# Altium schematic sheet WIEGAND_INTERFACE.SchDoc
size A4; SheetNumber: 21; SheetTotal: 27
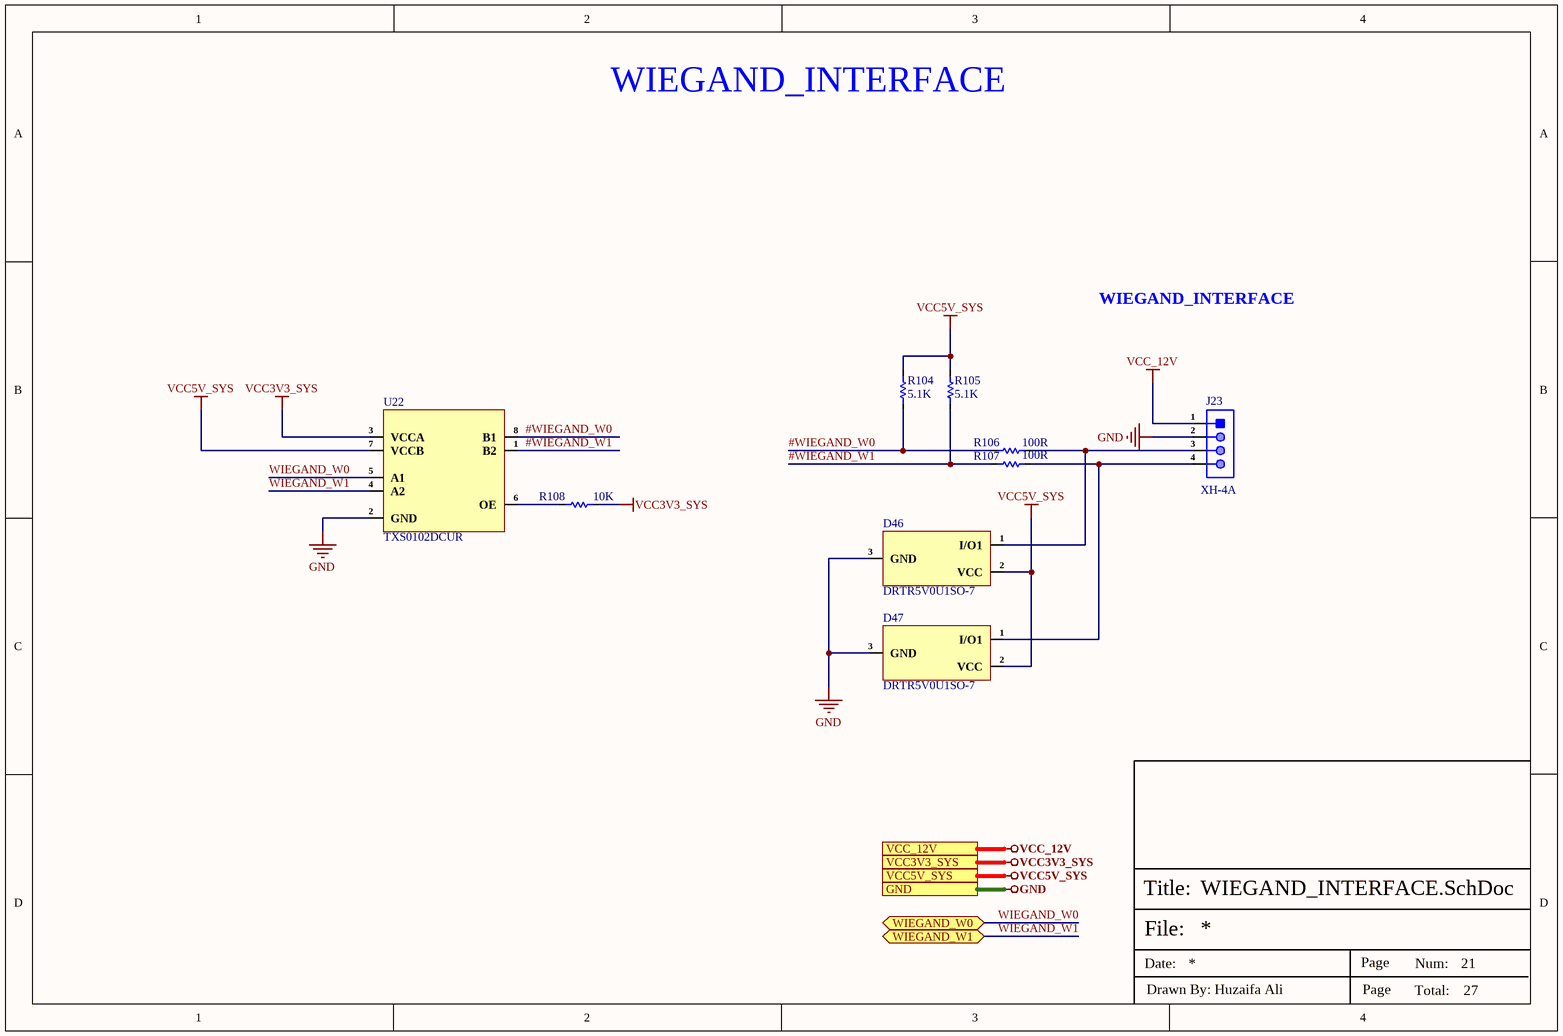
[diagram p0: WIEGAND_INTERFACE.SchDoc]

## Parts
D46  DRTR5V0U1SO-7  [SOT-23]
D47  DRTR5V0U1SO-7  [SOT-23]
J23  XH-4A  [XH-4A]
R104  5.1K  [Res-0402]
R105  5.1K  [Res-0402]
R106  100R  [Res-0402]
R107  100R  [Res-0402]
R108  10K  [Res-0402]
U22  TXS0102DCUR  [VSSOP-8(3.1x2.1)]

## Ports
GND (see TOP SHEET[3D], AUDIO_INTERFACE[1D], BUCK REGULATOR[3D], DEBUG_UART_INTERFACE[3D], DIGITAL IO_RELAY_SHEET[5D], DUAL_SIM_INTERFACE[3D], ETHERNET_PHY0[4D], ETHERNET_PHY1[4D], GSM_INTERFACE[2D], HDMI_INTERFACE[3D], INPUT_PROTECTION[3D], LINEAR_VOLTAGE_REG[3D], MICRO_SD_INTERFACE[3D], MIPI-DSI DISPLAY[3D], POWER SECTION[3D], PUSH BUTTONs_INTERFACE[3C], RGB_LEDs_INTERFACE[3D], ROCKCHIP_PWR_SUPPLY[1D], ROCKCHIP_SYSTEM_CONTROL[3C], RS232_RS485_INTERFACE[3C], SENSOR_SHEET[3D], USB2.0_INTERFACE[3D], USB3.0_INTERFACE[3D], USB-C_INTERFACE[2D], WIFI_BLUETOOTH_SHEET[4C]), VCC3V3_SYS (see TOP SHEET[3D], AUDIO_INTERFACE[1D], BUCK REGULATOR[3D], DEBUG_UART_INTERFACE[3D], DIGITAL IO_RELAY_SHEET[5D], ETHERNET_PHY0[4D], ETHERNET_PHY1[4D], GSM_INTERFACE[2D], HDMI_INTERFACE[3D], LINEAR_VOLTAGE_REG[3D], MIPI-DSI DISPLAY[3D], POWER SECTION[3D], PUSH BUTTONs_INTERFACE[3C], ROCKCHIP_PWR_SUPPLY[1D], ROCKCHIP_SYSTEM_CONTROL[3C], RS232_RS485_INTERFACE[3C], SENSOR_SHEET[3D], USB-C_INTERFACE[2D], WIFI_BLUETOOTH_SHEET[4C]), VCC5V_SYS (see TOP SHEET[3D], BUCK REGULATOR[3D], DIGITAL IO_RELAY_SHEET[5D], HDMI_INTERFACE[3D], LINEAR_VOLTAGE_REG[3D], MIPI-DSI DISPLAY[3D], POWER SECTION[3D], RGB_LEDs_INTERFACE[3D], ROCKCHIP_PWR_SUPPLY[1D], USB2.0_INTERFACE[3D], USB3.0_INTERFACE[3D], USB-C_INTERFACE[2D]), VCC_12V (see TOP SHEET[3D], AUDIO_INTERFACE[1D], BUCK REGULATOR[3D], INPUT_PROTECTION[3D], POWER SECTION[3D], PUSH BUTTONs_INTERFACE[3C]), WIEGAND_W0 (bidir, see TOP SHEET[3D], ROCKCHIP_GPIO_NC PINS[2D]), WIEGAND_W1 (bidir, see TOP SHEET[3D], ROCKCHIP_GPIO_NC PINS[2D])

## Nets
GND: D46.3(GND) D47.3(GND) J23.2 U22.2(GND) ; port GND
VCC3V3_SYS: R108.2 U22.3(VCCA) ; port VCC3V3_SYS
VCC5V_SYS: D46.2(VCC) D47.2(VCC) R104.2 R105.2 U22.7(VCCB) ; port VCC5V_SYS
VCC_12V: J23.1 ; port VCC_12V
#WIEGAND_W0: R104.1 R106.1 U22.8(B1)
#WIEGAND_W1: R105.1 R107.1 U22.1(B2)
WIEGAND_W0: U22.5(A1) ; port WIEGAND_W0
WIEGAND_W1: U22.4(A2) ; port WIEGAND_W1
NetD46_1: D46.1(I/O1) J23.3 R106.2
NetD47_1: D47.1(I/O1) J23.4 R107.2
NetR108_1: R108.1 U22.6(OE)

## Notes on the sheet
- WIEGAND_INTERFACE
- File:
- Title:
- Date:
- Page
- Num:
- Total:
- Drawn By: Huzaifa Ali

## Library data of the parts
D46 D47 = DRTR5V0U1SO-7: TVS DIODE 5.5VWM SOT23; Manufacturer: Diodes; Item Type: (TVS/ESD); Supplier: Digikey; Supplier Part Number: DRTR5V0U1SO-7DICT-ND; Manufacturer Part Number: DRTR5V0U1SO-7; RoHS: Yes; Category: TVS Diodes; Stock: 83982; Pricing: 1=0.34, 10=0.238, 100=0.1201, 500=0.098, 1000=0.07271 (USD); ComponentLink1URL: http://www.farnell.com/datasheets/2814436.pdf?src-supplier=Farnell; ComponentLink1Description: http://www.farnell.com/datasheets/2814436.pdf?src-supplier=Farnell; ComponentLink2URL: http://www.mouser.com/ds/2/115/DRTR5V0U1SO-271637.pdf?src-supplier=Mouser; ComponentLink2Description: http://www.mouser.com/ds/2/115/DRTR5V0U1SO-271637.pdf?src-supplier=Mouser; ComponentLink3URL: http://www.diodes.com/datasheets/DRTR5V0U1SO.pdf?src-supplier=Avnet; ComponentLink3Description: http://www.diodes.com/datasheets/DRTR5V0U1SO.pdf?src-supplier=Avnet; LCSC Part Number: C1973123
J23 = XH-4A: 1x4P 4P XH 1 Tin 2.5mm 4 -25℃~+85℃ Brass 3A Straight Plugin,P=2.5mm Wire To Board Connector ROHS; Manufacturer: HCTL; Manufacturer Part Number: XH-4A; Package: Plugin,P=2.5mm; LCSC Part Number: C2908602; Item Type: Wire To Board Connector; ComponentLink1Description: LCSC; ComponentLink1URL: https://www.lcsc.com/product-detail/Wire-To-Board-Connector_HCTL-XH-4A_C2908602.html
R104 R105 = RC0402FR-075K1L: RES 5.1K OHM 1% 1/16W 0402; Manufacturer: Yageo; Power Rating: 63mW; Resistance: 5.1kR; Temperature Coefficient: 100ppm/°C; Voltage Rating: 50V; Item Type: Resistor; Supplier 1: Avnet; Manufacturer Part Number: RC0402FR-075K1L; RoHS: Yes; Category: Chip SMD Resistors; Stock 1: 65000; Pricing 1: 10000=0.00085 (USD); Case/Package: 0402; Case Code (Metric): 1005; Case Code (Imperial): 0402; Min Operating Temperature: -55°C; Max Operating Temperature: 155°C; Tolerance: 1%; Technology: THICK FILM; Packaging: Tape and Reel; Package Quantity: 1; Resistor Type: Thick Film; Number of Terminations: 2; Termination: SMD/SMT; Max Power Dissipation: 63mW; Voltage Rating (DC): 50V; Working Voltage: 50V; Features: Moisture Resistant; Series: RC; Resistance Tolerance: 1%; Construction: Rectangular; Length: 1mm; Width: 0.02inch; Height: 0.016inch; Depth: 0.5mm; RoHS Compliant: Yes; Military Standard: Not; Lead Free: Lead Free; ComponentLink1URL: https://datasheet.ciiva.com/7983/1018594-7983519.pdf?src-supplier=Element14; ComponentLink1Description: https://datasheet.ciiva.com/7983/1018594-7983519.pdf?src-supplier=Element14; ComponentLink2URL: https://datasheet.ciiva.com/46394/1018594-46394936.pdf?src-supplier=Element14; ComponentLink2Description: https://datasheet.ciiva.com/46394/1018594-46394936.pdf?src-supplier=Element14; ComponentLink3URL: https://datasheet.ciiva.com/2453/pyu-r-int-thick-7-2453401.pdf?src-supplier=Digi-Key; ComponentLink3Description: https://datasheet.ciiva.com/2453/pyu-r-int-thick-7-2453401.pdf?src-supplier=Digi-Key; ComponentLink4URL: https://datasheet.ciiva.com/2453/pyu-r-int-thick-7-2453402.pdf?src-supplier=Digi-Key; ComponentLink4Description: https://datasheet.ciiva.com/2453/pyu-r-int-thick-7-2453402.pdf?src-supplier=Digi-Key; ComponentLink5URL: https://datasheet.ciiva.com/2453/pyu-r-int-thick-7-2453400.pdf?src-supplier=Digi-Key; ComponentLink5Description: https://datasheet.ciiva.com/2453/pyu-r-int-thick-7-2453400.pdf?src-supplier=Digi-Key; ComponentLink6URL: https://datasheet.ciiva.com/12558/pyu-rc0402-51-rohs-l-6-r-8721-12558460.pdf?src-supplier=Mouser; ComponentLink6Description: https://datasheet.ciiva.com/12558/pyu-rc0402-51-rohs-l-6-r-8721-12558460.pdf?src-supplier=Mouser; ComponentLink7URL: https://datasheet.ciiva.com/16744/pyu-rc0402-51-rohs-l-6-r-16744283.pdf?src-supplier=Future+Electronics; ComponentLink7Description: https://datasheet.ciiva.com/16744/pyu-rc0402-51-rohs-l-6-r-16744283.pdf?src-supplier=Future+Electronics; ComponentLink8URL: https://datasheet.ciiva.com/15189/getdatasheetpartid-323636-15189493.pdf?src-supplier=Verical; ComponentLink8Description: https://datasheet.ciiva.com/15189/getdatasheetpartid-323636-15189493.pdf?src-supplier=Verical; Supplier Part Number 1: RC0402FR-075K1L; LCSC Part Number: C105872
R106 R107 = RC0402FR-07100RL: RES 100 OHM 1% 1/16W 0402; Manufacturer: Yageo; Power Rating: 62.5mW; Voltage Rating: 50V; Temperature Coefficient: 100ppm/°C; Max Power Dissipation: 63mW; Item Type: Resistor; Supplier 1: Mouser; Manufacturer Part Number: RC0402FR-07100RL; RoHS: Yes; Category: Chip SMD Resistors; Stock 1: 699545; Pricing 1: 1=0.10000, 10=0.01200, 50=0.01200, 100=0.00500, 1000=0.00300, 2500=0.00200, 10000=0.00100 (USD); Case/Package: 0402; Number of Pins: 2; Case Code (Imperial): 0402; Case Code (Metric): 1005; Size Code: 0402; Min Operating Temperature: -55°C; Max Operating Temperature: 155°C; Tolerance: 1%; Voltage Rating (DC): 50V; Resistance: 100R; Packaging: Tape and Reel; Termination: SMD/SMT; Resistor Type: Thick Film; Features: Moisture Resistant; Series: RC; Number of Terminations: 2; Resistance Tolerance: 1%; Construction: Rectangular; Technology: THICK FILM; Length: 1mm; Width: 0.5mm; Height: 0.32mm; Depth: 0.5mm; RoHS Compliant: Yes; REACH SVHC: No SVHC; Military Standard: Not; Lead Free: Lead Free; ComponentLink1URL: https://datasheet.ciiva.com/11808/0900766b80c66297-11808765.pdf?src-supplier=RSComponents; ComponentLink1Description: https://datasheet.ciiva.com/11808/0900766b80c66297-11808765.pdf?src-supplier=RSComponents; ComponentLink2URL: https://datasheet.ciiva.com/7849/1784430-7849810.pdf?src-supplier=Element14; ComponentLink2Description: https://datasheet.ciiva.com/7849/1784430-7849810.pdf?src-supplier=Element14; ComponentLink3URL: https://datasheet.ciiva.com/28367/1018594-28367226.pdf?src-supplier=Element14; ComponentLink3Description: https://datasheet.ciiva.com/28367/1018594-28367226.pdf?src-supplier=Element14; ComponentLink4URL: https://datasheet.ciiva.com/22747/1018594-22747511.pdf?src-supplier=Element14; ComponentLink4Description: https://datasheet.ciiva.com/22747/1018594-22747511.pdf?src-supplier=Element14; ComponentLink5URL: https://datasheet.ciiva.com/12667/pyu-rc0402-51-rohs-l-6-r-12667957.pdf?src-supplier=Mouser; ComponentLink5Description: https://datasheet.ciiva.com/12667/pyu-rc0402-51-rohs-l-6-r-12667957.pdf?src-supplier=Mouser; ComponentLink6URL: https://datasheet.ciiva.com/15189/getdatasheetpartid-329466-15189335.pdf?src-supplier=Verical; ComponentLink6Description: https://datasheet.ciiva.com/15189/getdatasheetpartid-329466-15189335.pdf?src-supplier=Verical; ComponentLink7URL: https://datasheet.ciiva.com/16740/pyu-rc0402-51-rohs-l-6-r-16740566.pdf?src-supplier=Future+Electronics; ComponentLink7Description: https://datasheet.ciiva.com/16740/pyu-rc0402-51-rohs-l-6-r-16740566.pdf?src-supplier=Future+Electronics; Supplier Part Number 1: 603-RC0402FR-07100RL; LCSC Part Number: C106232
R108 = RC0402FR-0710KL: RES 10K OHM 1% 1/16W 0402; Manufacturer: Yageo; Resistance: 10kR; Voltage Rating (DC): 50V; Temperature Coefficient: 100ppm/°C; Power Rating: 62.5mW; Max Power Dissipation: 63mW; Item Type: Resistor; Supplier 1: Mouser; Manufacturer Part Number: RC0402FR-0710KL; RoHS: Yes; Category: Chip SMD Resistors; Stock 1: 18648329; Pricing 1: 1=0.10000, 10=0.01400, 50=0.01400, 100=0.00500, 1000=0.00300, 10000=0.00200 (USD); Case/Package: 0402; Number of Pins: 2; Case Code (Imperial): 0402; Case Code (Metric): 1005; Min Operating Temperature: -55°C; Max Operating Temperature: 155°C; Resistor Type: Thick Film; Tolerance: 1%; Packaging: Tape and Reel; Voltage Rating: 50V; Termination: SMD/SMT; Working Voltage: 50V; Number of Terminations: 2; Features: Moisture Resistant; Series: RC; Resistance Tolerance: 1%; Construction: Rectangular; Length: 1mm; Width: 0.5mm; Height: 0.32mm; Depth: 0.5mm; Lead Pitch: 0.2mm; REACH SVHC: No SVHC; Lead Free: Lead Free; RoHS Compliant: Yes; Military Standard: Not; ComponentLink1URL: https://datasheet.ciiva.com/7660/38568-7660787.pdf?src-supplier=Element14; ComponentLink1Description: https://datasheet.ciiva.com/7660/38568-7660787.pdf?src-supplier=Element14; ComponentLink2URL: https://datasheet.ciiva.com/7849/1686128-7849814.pdf?src-supplier=Element14; ComponentLink2Description: https://datasheet.ciiva.com/7849/1686128-7849814.pdf?src-supplier=Element14; ComponentLink3URL: https://datasheet.ciiva.com/7983/1018594-7983486.pdf?src-supplier=Element14; ComponentLink3Description: https://datasheet.ciiva.com/7983/1018594-7983486.pdf?src-supplier=Element14; ComponentLink4URL: https://datasheet.ciiva.com/22747/1018594-22747512.pdf?src-supplier=Element14; ComponentLink4Description: https://datasheet.ciiva.com/22747/1018594-22747512.pdf?src-supplier=Element14; ComponentLink5URL: https://datasheet.ciiva.com/12667/pyu-rc0402-51-rohs-l-6-r-12667067.pdf?src-supplier=Mouser; ComponentLink5Description: https://datasheet.ciiva.com/12667/pyu-rc0402-51-rohs-l-6-r-12667067.pdf?src-supplier=Mouser; ComponentLink6URL: https://datasheet.ciiva.com/7849/1784430-7849813.pdf?src-supplier=Element14; ComponentLink6Description: https://datasheet.ciiva.com/7849/1784430-7849813.pdf?src-supplier=Element14; ComponentLink7URL: https://datasheet.ciiva.com/7849/1784430-7849815.pdf?src-supplier=Element14; ComponentLink7Description: https://datasheet.ciiva.com/7849/1784430-7849815.pdf?src-supplier=Element14; Supplier Part Number 1: 603-RC0402FR-0710KL; LCSC Part Number: C60490
U22 = TXS0102DCUR: IC TRANSLTR BIDIRECTIONAL 8VSSOP; Manufacturer: Texas Instruments; Number of Outputs: 2NUMBER; Number of Inputs: 2; Nominal Supply Current: 14.4uA; Output Current: 1A; Min Supply Voltage: 1.65V; Max Supply Voltage: 5.5V; Data Rate: 24Mbps; Propagation Delay: 4.6ns; Logic Function: Translator; Turn-On Delay Time: 260ns; High Level Output Current: -20uA; Low Level Output Current: 1mA; Number of Circuits: 1; Supplier: Mouser; Supplier Part Number: 595-TXS0102DCUR; Manufacturer Part Number: TXS0102DCUR; RoHS: Yes; Category: Voltage Level Shifters; Stock: 149802; Pricing: 1=0.89, 10=0.739, 50=0.739, 100=0.561, 1000=0.383, 10000=0.313 (USD); Case/Package: VSSOP; Pins: 8; Weight: 0.000339oz; Min Operating Temperature: -40°C; Max Operating Temperature: 85°C; Package Quantity: 3000; Number of Channels: 2; Packaging: Tape and Reel; Number of Bits: 2; Quiescent Current: 14.4uA; Series: -; Channel Type: Bidirectional; Length: 2.3mm; Width: 2mm; Height: 900um; Thickness: 850um; Radiation Hardening: No; Reach SVHC Compliant: No; Lead Free: Lead Free; RoHS Compliant: Yes; ComponentLink1URL: https://datasheet.ciiva.com/22653/1846850-22653373.pdf?src-supplier=Farnell; ComponentLink1Description: https://datasheet.ciiva.com/22653/1846850-22653373.pdf?src-supplier=Farnell; ComponentLink2URL: https://datasheet.ciiva.com/15096/getdatasheetpartid-118249-15096172.pdf?src-supplier=Verical; ComponentLink2Description: https://datasheet.ciiva.com/15096/getdatasheetpartid-118249-15096172.pdf?src-supplier=Verical; ComponentLink3URL: https://datasheet.ciiva.com/1508/1857232-1508821.pdf?src-supplier=Element14; ComponentLink3Description: https://datasheet.ciiva.com/1508/1857232-1508821.pdf?src-supplier=Element14; ComponentLink4URL: https://datasheet.ciiva.com/28499/1863639-28499676.pdf?src-supplier=Element14; ComponentLink4Description: https://datasheet.ciiva.com/28499/1863639-28499676.pdf?src-supplier=Element14; ComponentLink5URL: https://datasheet.ciiva.com/46395/1863639-46395871.pdf?src-supplier=Element14; ComponentLink5Description: https://datasheet.ciiva.com/46395/1863639-46395871.pdf?src-supplier=Element14; ComponentLink6URL: https://datasheet.ciiva.com/1899/txs0102-1899369.pdf?src-supplier=Digikey; ComponentLink6Description: https://datasheet.ciiva.com/1899/txs0102-1899369.pdf?src-supplier=Digikey; ComponentLink7URL: https://datasheet.ciiva.com/1899/txs0102-1899368.pdf?src-supplier=Digikey; ComponentLink7Description: https://datasheet.ciiva.com/1899/txs0102-1899368.pdf?src-supplier=Digikey; ComponentLink8URL: https://datasheet.ciiva.com/1899/txs0102-1899370.pdf?src-supplier=Digikey; ComponentLink8Description: https://datasheet.ciiva.com/1899/txs0102-1899370.pdf?src-supplier=Digikey; ComponentLink9URL: https://datasheet.ciiva.com/14287/txs0102-14287516.pdf?src-supplier=Avnet; ComponentLink9Description: https://datasheet.ciiva.com/14287/txs0102-14287516.pdf?src-supplier=Avnet; ComponentLink10URL: https://datasheet.ciiva.com/14287/txs0102-14287518.pdf?src-supplier=Avnet; ComponentLink10Description: https://datasheet.ciiva.com/14287/txs0102-14287518.pdf?src-supplier=Avnet; LCSC Part Number: C53434; Item Type: IC